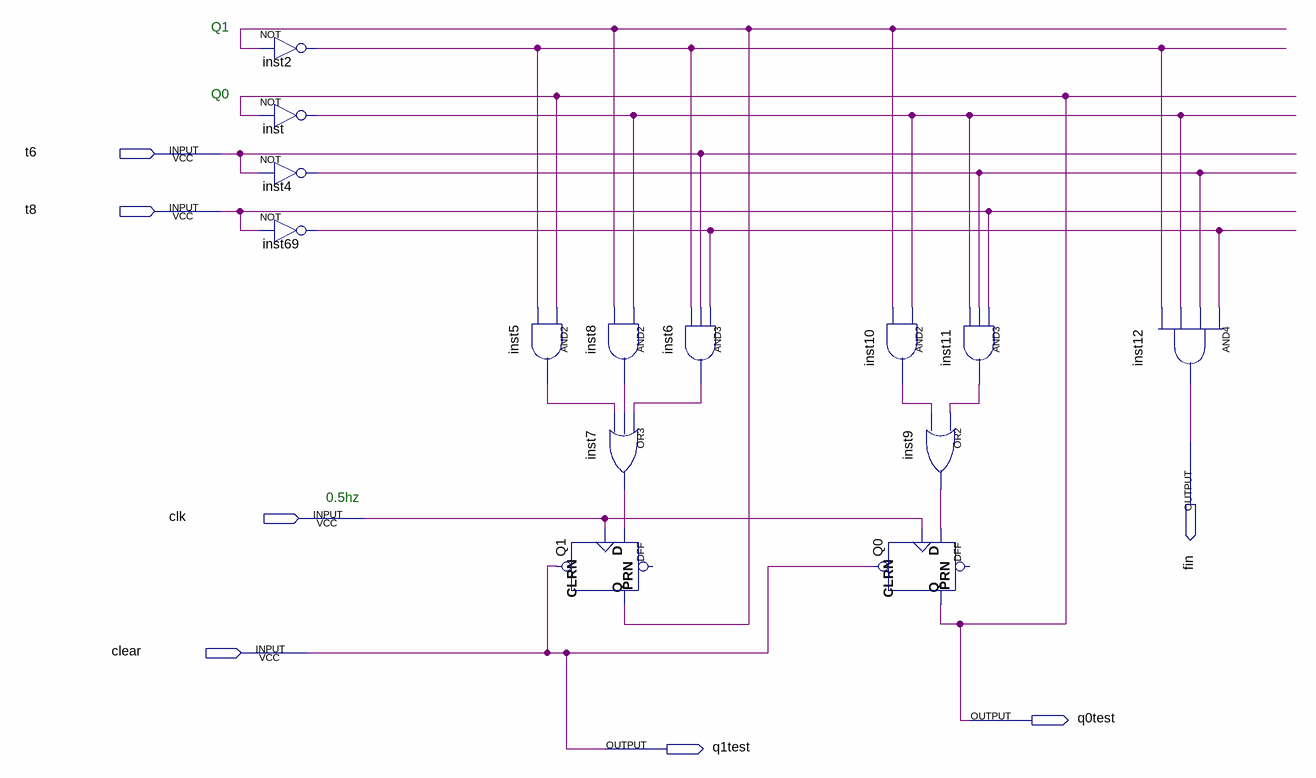
[diagram p0: schematic sheet]
// Quartus schematic T6_8.bdf as structural Verilog: 14 symbols, 7 pins
module T6_8 (
  input  t6,
  input  t8,
  input  clk,
  input  clear,
  output fin,
  output q0test,
  output q1test
);

  wire inst2_out, inst4_out, inst5_out, inst6_out, inst7_out, inst8_out, inst9_out, inst10_out, inst11_out,
       inst69_out, inst_out, Q1_q;

  not inst2 (inst2_out, Q1_q);
  not inst (inst_out, q0test);
  not inst4 (inst4_out, t6);
  not inst69 (inst69_out, t8);
  and inst5 (inst5_out, q0test, inst2_out);
  DFF Q1 (.CLRN(clear), .CLK(clk), .D(inst7_out), .Q(Q1_q));  // open: PRN
  and inst8 (inst8_out, inst_out, Q1_q);
  or inst7 (inst7_out, inst6_out, inst8_out, inst5_out);
  and inst6 (inst6_out, inst69_out, t6, inst2_out);
  and inst10 (inst10_out, inst_out, Q1_q);
  DFF Q0 (.CLRN(clear), .CLK(clk), .D(inst9_out), .Q(q0test));  // open: PRN
  and inst11 (inst11_out, t8, inst4_out, inst_out);
  or inst9 (inst9_out, inst11_out, inst10_out);
  and inst12 (fin, inst69_out, inst4_out, inst_out, inst2_out);

  assign q1test = clear;

  // Notes on the sheet:
  //   Q1
  //   Q0
  //   0.5hz
endmodule
